# Altium schematic sheet IMU_sensor_gyro.SchDoc
size 420 x 297 mm; SheetNumber: 2; SheetTotal: 4
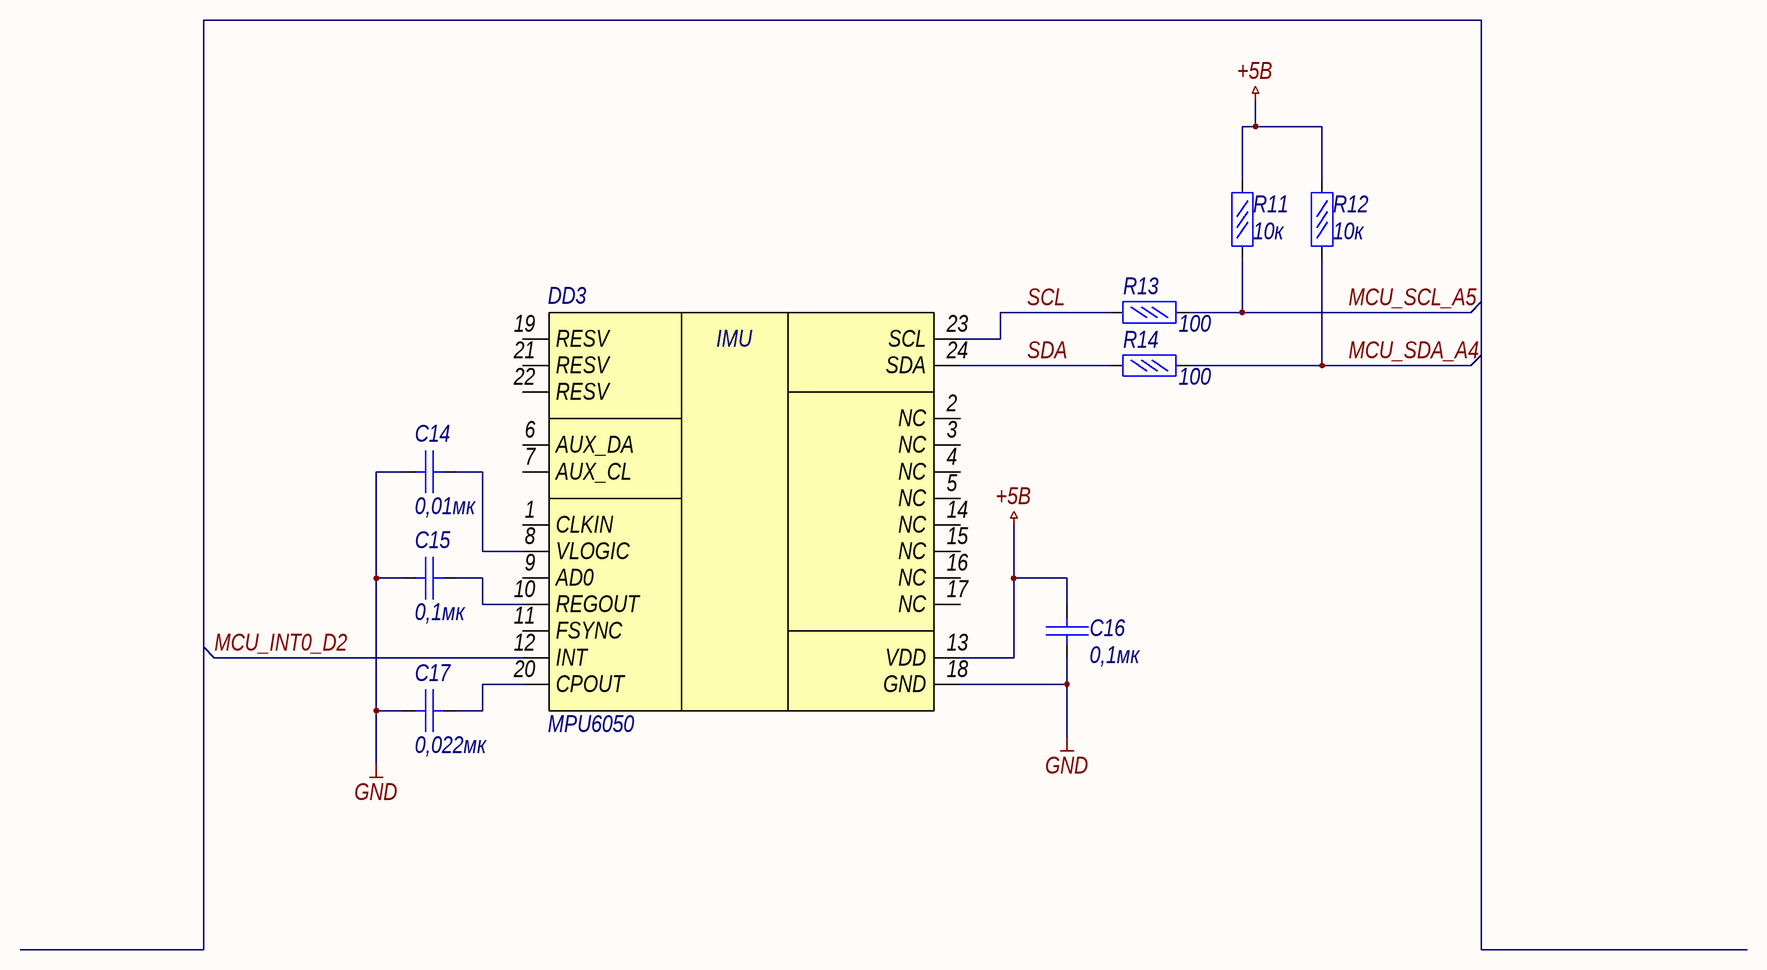
[diagram p0: IMU_sensor_gyro.SchDoc]

## Parts
DD3  MPU6050  [QFN24-PAD]
R11  10к  [R0402]
R12  10к  [R0402]
R13  100  [R0402]
R14  100  [R0402]
С14  0,01мк  [C0402]
С15  0,1мк  [C0402]
С16  0,1мк  [C0402]
С17  0,022мк  [C0402]

## Nets
+5В: DD3.13(VDD) R11.2 R12.2 С16.2
GND: DD3.18(GND) С14.1 С15.1 С16.1 С17.1
MCU_INT0_D2: DD3.12(INT)
MCU_SCL_A5: R11.1 R13.1
MCU_SDA_A4: R12.1 R14.1
SCL: DD3.23(SCL) R13.2
SDA: DD3.24(SDA) R14.2
NetDD3_8: DD3.8(VLOGIC) С14.2
NetDD3_10: DD3.10(REGOUT) С15.2
NetDD3_20: DD3.20(CPOUT) С17.2

Not connected (* = marked no-connect by the designer): DD3 1(CLKIN) 2(NC) 3(NC) 4(NC) 5(NC) 6(AUX_DA) 7(AUX_CL) 9(AD0) 11(FSYNC) 14(NC) 15(NC) 16(NC) 17(NC) 19(RESV) 21(RESV) 22(RESV)

## Notes on the sheet
- Подп. и дата
- Инв. № дубл.
- Взам. инв. №
- Инв. № подл.
- Лист
- Изм.
- № докум.
- Подп.
- Дата
- Копировал
- Формат
- А3
- (in symbol MPU6050) IMU

## Library data of the parts
R11-R14 = Резистор 0.05Вт: Резистор 0,05Вт
  R11 R12: Value: 10к
  R13 R14: Value: 100
С14-С17 = Кер. конденсатор
  С14: Value: 0,01мк
  С15 С16: Value: 0,1мк
  С17: Value: 0,022мк
DD3 = MPU6050: Name: MPU6050